# Altium schematic sheet list1.SchDoc
size A4; SheetNumber: 1; SheetTotal: 1
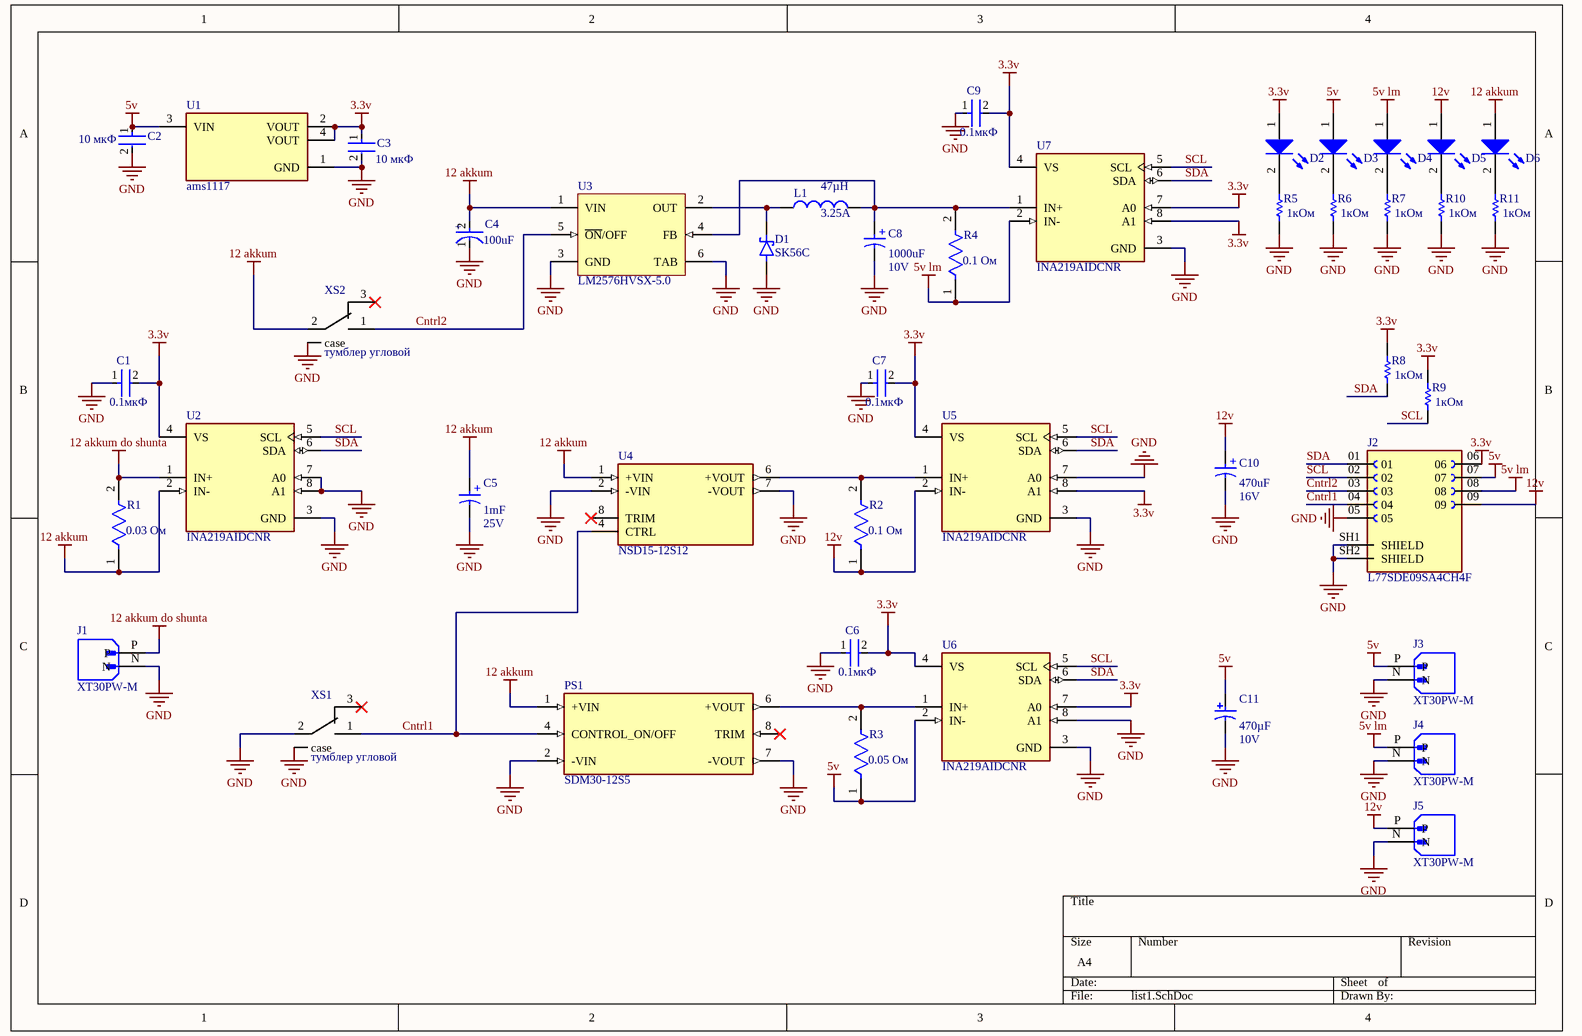
[diagram p0: list1.SchDoc]

## Parts
C1  value 0.1мкФ  [FP-C0805C-DN-IPC_A]  (hidden comment: C0805C104K5RACTU)
C2  value 10 мкФ  [FP-C0805C-DN-IPC_A]  (hidden comment: C0805C104K5RACTU)
C3  value 10 мкФ  [FP-C0805C-DN-IPC_A]  (hidden comment: C0805C104K5RACTU)
C4  Capacitance: 100uF  [FP-T495D107K016ATE125-MFG]  (hidden comment: T495D107K016ATE125)
C5  Voltage Rating: 25V  Capacitance: 1mF  [10*12.5]  (hidden comment: 865060257010)
C6  value 0.1мкФ  [FP-C0805C-DN-IPC_A]  (hidden comment: C0805C104K5RACTU)
C7  value 0.1мкФ  [FP-C0805C-DN-IPC_A]  (hidden comment: C0805C104K5RACTU)
C8  Voltage Rating: 10V  Capacitance: 1000uF  [WCAP-ASLL_D10H10.5]  (hidden comment: 865060257010)
C9  value 0.1мкФ  [FP-C0805C-DN-IPC_A]  (hidden comment: C0805C104K5RACTU)
C10  Voltage Rating: 16V  Capacitance: 470uF  [WCAP-ASLL_D10H10.5]  (hidden comment: 865060257010)
C11  Capacitance: 470µF  Rated Voltage: 10V  [PNSC-FK-V-F_V]  (hidden comment: EEEFK1C471P)
D1  SK56C  [DIOM6859X262N]
D2  Infrared, 1.5V, 30°  [WL-TIRC_3mm]  (value not drawn)
D3  Infrared, 1.5V, 30°  [WL-TIRC_3mm]  (value not drawn)
D4  Infrared, 1.5V, 30°  [WL-TIRC_3mm]  (value not drawn)
D5  Infrared, 1.5V, 30°  [WL-TIRC_3mm]  (value not drawn)
D6  Infrared, 1.5V, 30°  [WL-TIRC_3mm]  (value not drawn)
J1  XT30PW-M  [AMASS_XT30PW-M]
J2  L77SDE09SA4CH4F  [AMPHENOL_L77SDE09SA4CH4F]
J3  XT30PW-M  [AMASS_XT30PW-M]
J4  XT30PW-M  [AMASS_XT30PW-M]
J5  XT30PW-M  [AMASS_XT30PW-M]
L1  Current Rating: 3.25A  Inductance: 47µH  [SUMI-CDRH127_V]  (hidden comment: CDRH127/LDNP-470MC)
PS1  SDM30-12S5  [CONV_SDM30-12S5]
R1  Resistance: 0.03 Ом  [FP-CRCW2512-e3-IPC_A]  (hidden comment: CRCW25121R00FKEG)
R2  Resistance: 0.1 Ом  [FP-CRCW2512-e3-IPC_A]  (hidden comment: CRCW25121R00FKEG)
R3  Resistance: 0.05 Ом  [FP-CRCW2512-e3-IPC_A]  (hidden comment: CRCW25121R00FKEG)
R4  Resistance: 0.1 Ом  [FP-CRCW2512-e3-IPC_A]  (hidden comment: CRCW25121R00FKEG)
R5  Package Quantity: 1кОм  [RESC2013X70X40ML20T20]  (hidden comment: ERJ-6ENF1001V)
R6  Package Quantity: 1кОм  [RESC2013X70X40ML20T20]  (hidden comment: ERJ-6ENF1001V)
R7  Package Quantity: 1кОм  [RESC2013X70X40ML20T20]  (hidden comment: ERJ-6ENF1001V)
R8  Package Quantity: 1кОм  [RESC2013X70X40ML20T20]  (hidden comment: ERJ-6ENF1001V)
R9  Package Quantity: 1кОм  [RESC2013X70X40ML20T20]  (hidden comment: ERJ-6ENF1001V)
R10  Package Quantity: 1кОм  [RESC2013X70X40ML20T20]  (hidden comment: ERJ-6ENF1001V)
R11  Package Quantity: 1кОм  [RESC2013X70X40ML20T20]  (hidden comment: ERJ-6ENF1001V)
U1  ams1117  [FP-ams1117-IPC_A]
U2  INA219AIDCNR  [FP-DCN0008A-IPC_C]
U3  LM2576HVSX-5.0  [KTT0005B_M]
U4  NSD15-12S12  [CONV_NSD15-12S5]
U5  INA219AIDCNR  [FP-DCN0008A-IPC_C]
U6  INA219AIDCNR  [FP-DCN0008A-IPC_C]
U7  INA219AIDCNR  [FP-DCN0008A-IPC_C]
XS1  тумблер угловой  [тумблер угловой]
XS2  тумблер угловой  [тумблер угловой]

## Nets
3.3v: C1.2 C3.1 C6.2 C7.2 C9.2 D2.1(A) J2.06 R8.2 R9.2 U1.2(VOUT) U1.4(VOUT) U2.4(VS) U5.4(VS) U5.8(A1) U6.4(VS) U6.7(A0) U7.4(VS) U7.7(A0) U7.8(A1)
5v: C2.1 C11.1 D3.1(A) J2.07 J3.P R3.1 U1.3(VIN) U6.2(IN-)
5v lm: D4.1(A) J2.08 J4.P R4.1 U7.2(IN-)
12 akkum: C4.2(A) C5.1(P) D6.1(A) PS1.1(+VIN) R1.1 U2.2(IN-) U3.1(VIN) U4.1(+VIN) XS2.2
12 akkum do shunta: J1.P R1.2 U2.1(IN+)
12v: C10.1(P) D5.1(A) J2.09 J5.P R2.1 U5.2(IN-)
GND: C1.1 C2.2 C3.2 C4.1(C) C5.2(N) C6.1 C7.1 C8.2(N) C9.1 C10.2(N) C11.2 D1.A J1.N J2.05 J2.SH1(SHIELD) J2.SH2(SHIELD) J3.N J4.N J5.N PS1.2(-VIN) PS1.7(-VOUT) R5.1 R6.1 R7.1 R10.1 R11.1 U1.1(GND) U2.3(GND) U2.7(A0) U2.8(A1) U3.3(GND) U3.6(TAB) U4.2(-VIN) U4.7(-VOUT) U5.3(GND) U5.7(A0) U6.3(GND) U6.8(A1) U7.3(GND) XS1.0(case) XS1.2 XS2.0(case)
Cntrl1: J2.04 PS1.4(CONTROL_ON/OFF) U4.4(CTRL) XS1.1
Cntrl2: J2.03 U3.5(~{ON}/OFF) XS2.1
SCL: J2.02 R9.1 U2.5(SCL) U5.5(SCL) U6.5(SCL) U7.5(SCL)
SDA: J2.01 R8.1 U2.6(SDA) U5.6(SDA) U6.6(SDA) U7.6(SDA)
NetC8_1: C8.1(P) L1.2 R4.2 U3.4(FB) U7.1(IN+)
NetD1_C: D1.C(K) L1.1 U3.2(OUT)
NetD2_2: D2.2(K) R5.2
NetD3_2: D3.2(K) R6.2
NetD4_2: D4.2(K) R7.2
NetD5_2: D5.2(K) R10.2
NetD6_2: D6.2(K) R11.2
NetPS1_6: PS1.6(+VOUT) R3.2 U6.1(IN+)
NetR2_2: R2.2 U4.6(+VOUT) U5.1(IN+)

Not connected (* = marked no-connect by the designer): PS1 8(TRIM)*; U4 8(TRIM)*; XS1 3*; XS2 3*

## Notes on the sheet
- (in symbol CMP-2000-07207-2) +
- (in symbol CMP-03913-54202466-2) +
- (in symbol konder) +

## Library data of the parts
C1 C6 C7 C9 = CMP-2007-00279-2: CAP CER 0.1UF 50V X7R 0805; Manufacturer: KEMET; Tolerance: 0.1; Temperature Coefficient: 30ppm/°C; Material: Ceramic; Capacitance: 0.10 μF; Manufacturer Part Number: C0805C104K5RACTU; Device Class L2: Capacitors; Temperature Range Low: -55°C; Voltage Rating: 50 V; Digikey Description: CAP CER 0.1UF 50V X7R 0805; Category: Cap; ComponentLink2Description: Datasheet; Octopart: https://octopart.com/c0805c104k5ractu-kemet-143926; RoHS: TRUE; ComponentLink2URL: https://content.kemet.com/datasheets/KEM_C1003_C0G_SMD.pdf; Temperature Characteristic: X7R; Temperature: -55°C to +125°C; Height: 0.88mm; Temperature Range High: +125°C; Device Class L1: Passive Components; Automotive: No; Lead Free: Yes; Ipc Land Pattern Name: CAPC200125X78; Device Class L3: Ceramic Capacitors; Mouser Description: Cap Ceramic 0.1uF 50V X7R 10% SMD 2.0 x 1.2 mm 125 C Paper T/R; Package: C0805C-DN
C2 C3 = CMP-2007-00279-2: CAP CER 10UF 50V X7R 0805; Manufacturer: KEMET; Tolerance: 0.1; Temperature Coefficient: 30ppm/°C; Material: Ceramic; Capacitance: 0.10 μF; Manufacturer Part Number: C0805C104K5RACTU; Device Class L2: Capacitors; Temperature Range Low: -55°C; Voltage Rating: 50 V; Digikey Description: CAP CER 0.1UF 50V X7R 0805; Category: Cap; ComponentLink2Description: Datasheet; Octopart: https://octopart.com/c0805c104k5ractu-kemet-143926; RoHS: TRUE; ComponentLink2URL: https://content.kemet.com/datasheets/KEM_C1003_C0G_SMD.pdf; Temperature Characteristic: X7R; Temperature: -55°C to +125°C; Height: 0.88mm; Temperature Range High: +125°C; Device Class L1: Passive Components; Automotive: No; Lead Free: Yes; Ipc Land Pattern Name: CAPC200125X78; Device Class L3: Ceramic Capacitors; Mouser Description: Cap Ceramic 0.1uF 50V X7R 10% SMD 2.0 x 1.2 mm 125 C Paper T/R; Package: C0805C-DN
C4 = CMP-2000-07207-2: CAP TANT 100UF 10% 16V 2917; Life (Hours): 2000Hour; ESR (Equivalent Series Resistance): 125mR; Polarity: Polar; Dielectric Material: Tantalum; Dissipation Factor: 8%; Radiation Hardening: No; RoHS Compliant: Yes; Length: 7.3mm; Features: General Purpose; Packaging: Tape and Reel; Package Quantity: 1; Weight: 0.023634oz; Voltage Rating: 16V; Width: 0.169inch; Case/Package: 2917; Mount: Surface Mount; Voltage: 16V; Min Operating Temperature: -55°C; Tolerance: 10%; REACH SVHC: No SVHC; Height - Seated (Max): 0.122inch; Number of Pins: 2; Construction: Flat; Depth: 4.3mm; Series: T495; Max Operating Temperature: 125°C; Failure Rate: 0.001%; Termination: SMD/SMT; Voltage Rating (DC): 16V; Case Code (Imperial): 2917; Case Code (Metric): 7343; Height: 2.8mm
C5 = konder: 865060257010 WCAP-ASLL Aluminum Electrolytic Capacitors 1000uf 25V; NexarPartId: 54202466; ESR (Equivalent Series Resistance): 99.9268mΩ; Insulation Resistance: 100kΩ; Voltage Rating (DC): 10V; Life (Hours): 5000hours; Ripple Current: 690mA; Impedance: 90mΩ; Polarity: Polar; Leakage Current: 100µA; Tolerance: 20%; Diameter: 10mm; Min Operating Temperature: -55°C; Max Operating Temperature: 105°C; Length: 12.5mm; Height: 10.5mm; Height - Seated (Max): 10.4902mm; Mount: Surface Mount; Case/Package: Radial; REACH SVHC: Unknown; Ripple Current (AC): 690mA; RoHS: Compliant
C8 = CMP-03913-54202466-2: 865060257010 WCAP-ASLL Aluminum Electrolytic Capacitors 1000uf 10v; ESR (Equivalent Series Resistance): 99.9268mΩ; Insulation Resistance: 100kΩ; Life (Hours): 5000hours; Ripple Current: 690mA; Impedance: 90mΩ; Polarity: Polar; Leakage Current: 100µA; Tolerance: 20%; Diameter: 10mm; Min Operating Temperature: -55°C; Max Operating Temperature: 105°C; Length: 10.5mm; Voltage Rating (DC): 10V; Height: 10.5mm; Height - Seated (Max): 10.4902mm; Mount: Surface Mount; Case/Package: Radial; REACH SVHC: Unknown; NexarPartId: 54202466; Ripple Current (AC): 690mA; RoHS: Compliant
C10 = CMP-03913-54202466-2: 865060257010 WCAP-ASLL Aluminum Electrolytic Capacitors 470uf 16v; ESR (Equivalent Series Resistance): 99.9268mΩ; Insulation Resistance: 100kΩ; Voltage Rating (DC): 10V; Life (Hours): 5000hours; Ripple Current: 690mA; Impedance: 90mΩ; Polarity: Polar; Leakage Current: 100µA; Tolerance: 20%; Diameter: 10mm; Min Operating Temperature: -55°C; Max Operating Temperature: 105°C; Length: 10.5mm; Height: 10.5mm; Height - Seated (Max): 10.4902mm; Mount: Surface Mount; Case/Package: Radial; REACH SVHC: Unknown; NexarPartId: 54202466; Ripple Current (AC): 690mA; RoHS: Compliant
C11 = CMP-2000-06204-1: Aluminum Electrolytic Capacitor, 470 uF, +/- 20%, 10 V, 2-Pin SMD (Size Code F), -55 to 105 degC, RoHS, Tape and Reel; Manufacturer: Panasonic; Type: Can; Ripple Current: 600mA; Lifetime@Temperature: 2000Hrs@105°C; Impedance: 0.16O; Manufacturer URL: http://www.panasonic.com/; Package Description: 2-Pin Electrolytic Aluminum Capacitor, Body 8.3 x 8.3 mm; Operating Temp-Max: 105°C; Mounting Technology: SurfaceMount; Operating Temp Range: -55to+105°C; Datasheet Version: 03/2016; Series: FK; Package Reference: FK-V-F; Case Size/Dimension: Ø8x10.2mm; Package URL: http://industrial.panasonic.com/cdbs/www-data/pdf/RDE0000/DME0000COL48.pdf; Datasheet URL: http://industrial.panasonic.com/cdbs/www-data/pdf/RDE0000/ABA0000C1181.pdf
D1 = SK56C: 5A, 60V, Schottky Rectifier; MF: Taiwan Semiconductor; Purchase-URL: https://pricing.snapeda.com/search/part/SK56C/?ref=eda; Package: SMC-2 Taiwan Semiconductor; Availability: In Stock; Value: *; MP: SK56C; Check_prices: https://www.snapeda.com/parts/SK56C/Taiwan+Semiconductor/view-part/?ref=eda; Price: None; SnapEDA_Link: https://www.snapeda.com/parts/SK56C/Taiwan+Semiconductor/view-part/?ref=snap
D2-D6 = 15400385F3590: WL-TIRC THT Infrared Round Waterclear, 3mm, 60mW/sr, Infrared, 1.5V, 30°; Manufacturer: Wurth Elektronik; Centroid Wavelength: 845nm; Chip Technology: AlGaAs; Manufacturer Part Number: 15400385F3590; Category: Infrared LEDs; Match Code: WL-TIRC; ComponentLink1Description: Website Link; ComponentLink1URL: https://www.we-online.com/redexpert/article/15400385F3590?ad; ComponentLink2Description: Datasheet Link; ComponentLink2URL: https://www.we-online.com/redexpert/spec/15400385F3590?ad; Mount: Through Hole; Operating Temperature Max: 85°C; Operating Temperature Min: -40°C; Packaging: Bulk; Height: 5.3mm; Diameter: 3.85mm; Emitting Color: Infrared; Forward Voltage: 1.5V; Radiant Intensity: 60mW/sr; Viewing Angle: 30°
J1 J3-J5 = XT30PW-M: Socket; DC supply; XT30; male; PIN: 2; on PCBs; THT; Colour: yellow; MF: AMASS; SnapEDA_Link: https://www.snapeda.com/parts/XT30PW-M/AMASS/view-part/?ref=snap; Package: None; Value: *; MP: XT30PW-M; Check_prices: https://www.snapeda.com/parts/XT30PW-M/AMASS/view-part/?ref=eda
J2 = L77SDE09SA4CH4F: Connector d-sub rt angle pcb recept 4-40 threaded hole w/screwlock 9 socket cont | Amphenol Commercial (Amphenol CS) L77SDE09SA4CH4F; MF: Amphenol ICC (Commercial Products); SnapEDA_Link: https://www.snapeda.com/parts/L77SDE09SA4CH4F/Amphenol/view-part/?ref=snap; Package: None; Value: *; MP: L77SDE09SA4CH4F; Check_prices: https://www.snapeda.com/parts/L77SDE09SA4CH4F/Amphenol/view-part/?ref=eda
L1 = CMP-2000-06084-1: Power Inductor, 10 uH, +/- 20%, -40 to 100 degC, 2-Pin SMD, RoHS, Tape and Reel; Manufacturer: Sumida; Catalog Drawings: CDRH127SeriesFrontCDRH127SeriesSideCDRH127SeriesBottom; Product Training Modules: PowerInductorBasics; Shielding: Shielded; Online Catalog: CDRHSeries; DC Resistance (DCR): 21.6mOhmMax; Other Names: 308-1457-1; Frequency - Test: 1kHz; Mounting Type: SurfaceMount; Datasheet Version: 01/2014; Package Description: 2-Pin Surface Mount Device, Body 12 x 12 mm; Frequency - Self Resonant: -; Package Reference: CDRH127; Category: Inductors,Coils,Chokes; Material - Core: -; Q @ Freq: -; Type: -; Family: FixedInductors; Ratings: -; Series: CDRH127; Manufacturer URL: http://www.sumida.com/; Operating Temperature: -40°C~100°C; Height - Seated (Max): 0.315"(8.00mm); Standard Package: 1; Size / Dimension: 0.472"Lx0.472"W(12.00mmx12.00mm); Current - Saturation: -; Datasheet URL: http://products.sumida.com/products/pdf/CDRH127.pdf; Package / Case: Nonstandard; Tolerance: ±20%; Mounting Technology: SurfaceMount; Packaging: CutTape(CT)
PS1 = SDM30-12S5: Isolated Module DC DC Converter 1 Output 5V 5A 9.2V - 18V Input; MF: MEAN WELL; Value: *; SnapEDA_Link: https://www.snapeda.com/parts/SDM30-12S5/MEAN%20WELL%20USA%20Inc./view-part/9848/?ref=snap; MP: SDM30-12S5; Check_prices: https://www.snapeda.com/parts/SDM30-12S5/MEAN%20WELL%20USA%20Inc./view-part/9848/?ref=eda; Package: DIP-8 Mean Well; Digi-Key_Part_Number: 1866-4448-ND; Purchase-URL: https://pricing.snapeda.com/search/part/SDM30-12S5/?ref=eda
R1-R4 = CMP-02407-006956-1: RES Thick Film, 1Ω, 1%, 1W, 100ppm/°C, 2512; Voltage Rating: 500V; Number of Terminations: 2; Packaging: Tape and Reel; Features: Automotive AEC-Q200; Military Standard: Not; Power Rating: 1W; Max Operating Temperature: 155°C; Number of Pins: 2; Radiation Hardening: No; Mount: Surface Mount; Height: 0.6mm; Max Power Dissipation: 1W; Case Code (Metric): 6432; Termination: SMD/SMT; REACH SVHC: No SVHC; Case/Package: 2512; Weight: 0.001429oz; Tolerance: 1%; Package Quantity: 2000; Composition: Thick Film; Temperature Coefficient: 100ppm/°C; Voltage Rating (DC): 500V; Width: 0.124inch; Length: 6.3mm; Lead Free: Lead Free; Min Operating Temperature: -55°C; Contact Plating: Tin; Case Code (Imperial): 2512; Depth: 3.15mm
R5-R11 = CMP-2001-04375-5: Chip Resistor, 1 KOhm, +/- 1%, 0.125 W, -55 to 155 degC, 0805 (2012 Metric), RoHS, Tape and Reel; Manufacturer: Panasonic; Voltage Rating: 150 V; ComponentLink1URL: http://www.panasonic.com/; ComponentLink2Description: Datasheet; REACH SVHC: Yes; ComponentLink1Description: Manufacturer URL; Length: 2 mm; Height: 0.6 mm; PackageDescription: 2-Pin Surface Mount Device, Body 2 x 1.25 mm; Packaging: Cut Tape; PackageReference: 0805; Max Operating Temperature: 155 degC; Mounting Technology: Surface Mount; ComponentLink2URL: http://industrial.panasonic.com/cdbs/www-data/pdf/RDA0000/AOA0000C86.pdf; DatasheetVersion: 04/2015; Min Operating Temperature: -55 degC; RoHSCompliant: true; Mount: Surface Mount
U1 = CMP-209535-000002-1: 1A LOW DROPOUT VOLTAGE REGULATOR 3.3V; RoHS Compliant: Yes
U2 U5-U7 = CMP-0704-00041-3: IC CURRENT MONITOR 1% SOT23-8; Common Mode Rejection Ratio: 100dB; Bandwidth: 3.4MHz; Operating Supply Current: 1mA; Nominal Supply Current: 700uA; Min Input Voltage: 0V; Output Current per Channel: 10mA; Number of Amplifiers: 1; Input Offset Voltage (Vos): 100uV; Max Input Voltage: 26V; Min Supply Voltage: 3V; Max Supply Current: 5mA; Max Supply Voltage: 5.5V; Output Type: Digital; Accuracy: 1%; Radiation Hardening: No; Min Operating Temperature: -40°C; Contact Plating: Gold; REACH SVHC: No SVHC; Packaging: Tape and Reel; Max Operating Temperature: 125°C; Lead Free: Lead Free; Weight: 0.001411oz; Supply Current: 700uA; Number of Pins: 8; Length: 3mm; Quiescent Current: 700uA; Features: I²C; Height: 1.3mm; Output Current: 10mA; Case/Package: SOT-23-8; RoHS Compliant: Yes; Width: 1.75mm; Package Quantity: 3000; Series: Zero-Drift
U3 = CMP-0069-00141-3: SIMPLE SWITCHER® 3A Step-Down Voltage Regulator, 5-pin TO-263; Manufacturer: Texas Instruments; PackageTopMarking: NSUZXYTTE#*LM2576*HVS-5.0 P+; PowerWise: N; RoHS: N; PackageDescription: TO-263, Molded, .400 x .390 x .180in, 5 Lead, .067in Pitch, Surface Mount; Code_JEDEC: MO-169-AB; CompType: Switcher; ComponentLink1URL: http://www.ti.com/general/docs/lit/getliterature.tsp?genericPartNumber=LM2576HV&fileType=pdf; ComponentLink1Description: Datasheet URL; PinCount: 5; PackageReference: KTT0005B
U4 = NSD15-12S12: Isolated Module DC DC Converter 1 Output 5V 3A 9.4V - 36V Input; MP: NSD15-12S5; MF: MEAN WELL; SnapEDA_Link: https://www.snapeda.com/parts/NSD15-12S5/MEAN%20WELL%20USA%20Inc./view-part/356097/?ref=snap; Value: *; Package: DIP-8 Mean Well; Digi-Key_Part_Number: 1866-3633-ND
XS1 XS2 = тумблер угловой: SMTS-102-2C4